# EAGLE design HTVC8038_Power_v12 (EAGLE 7.4.0)
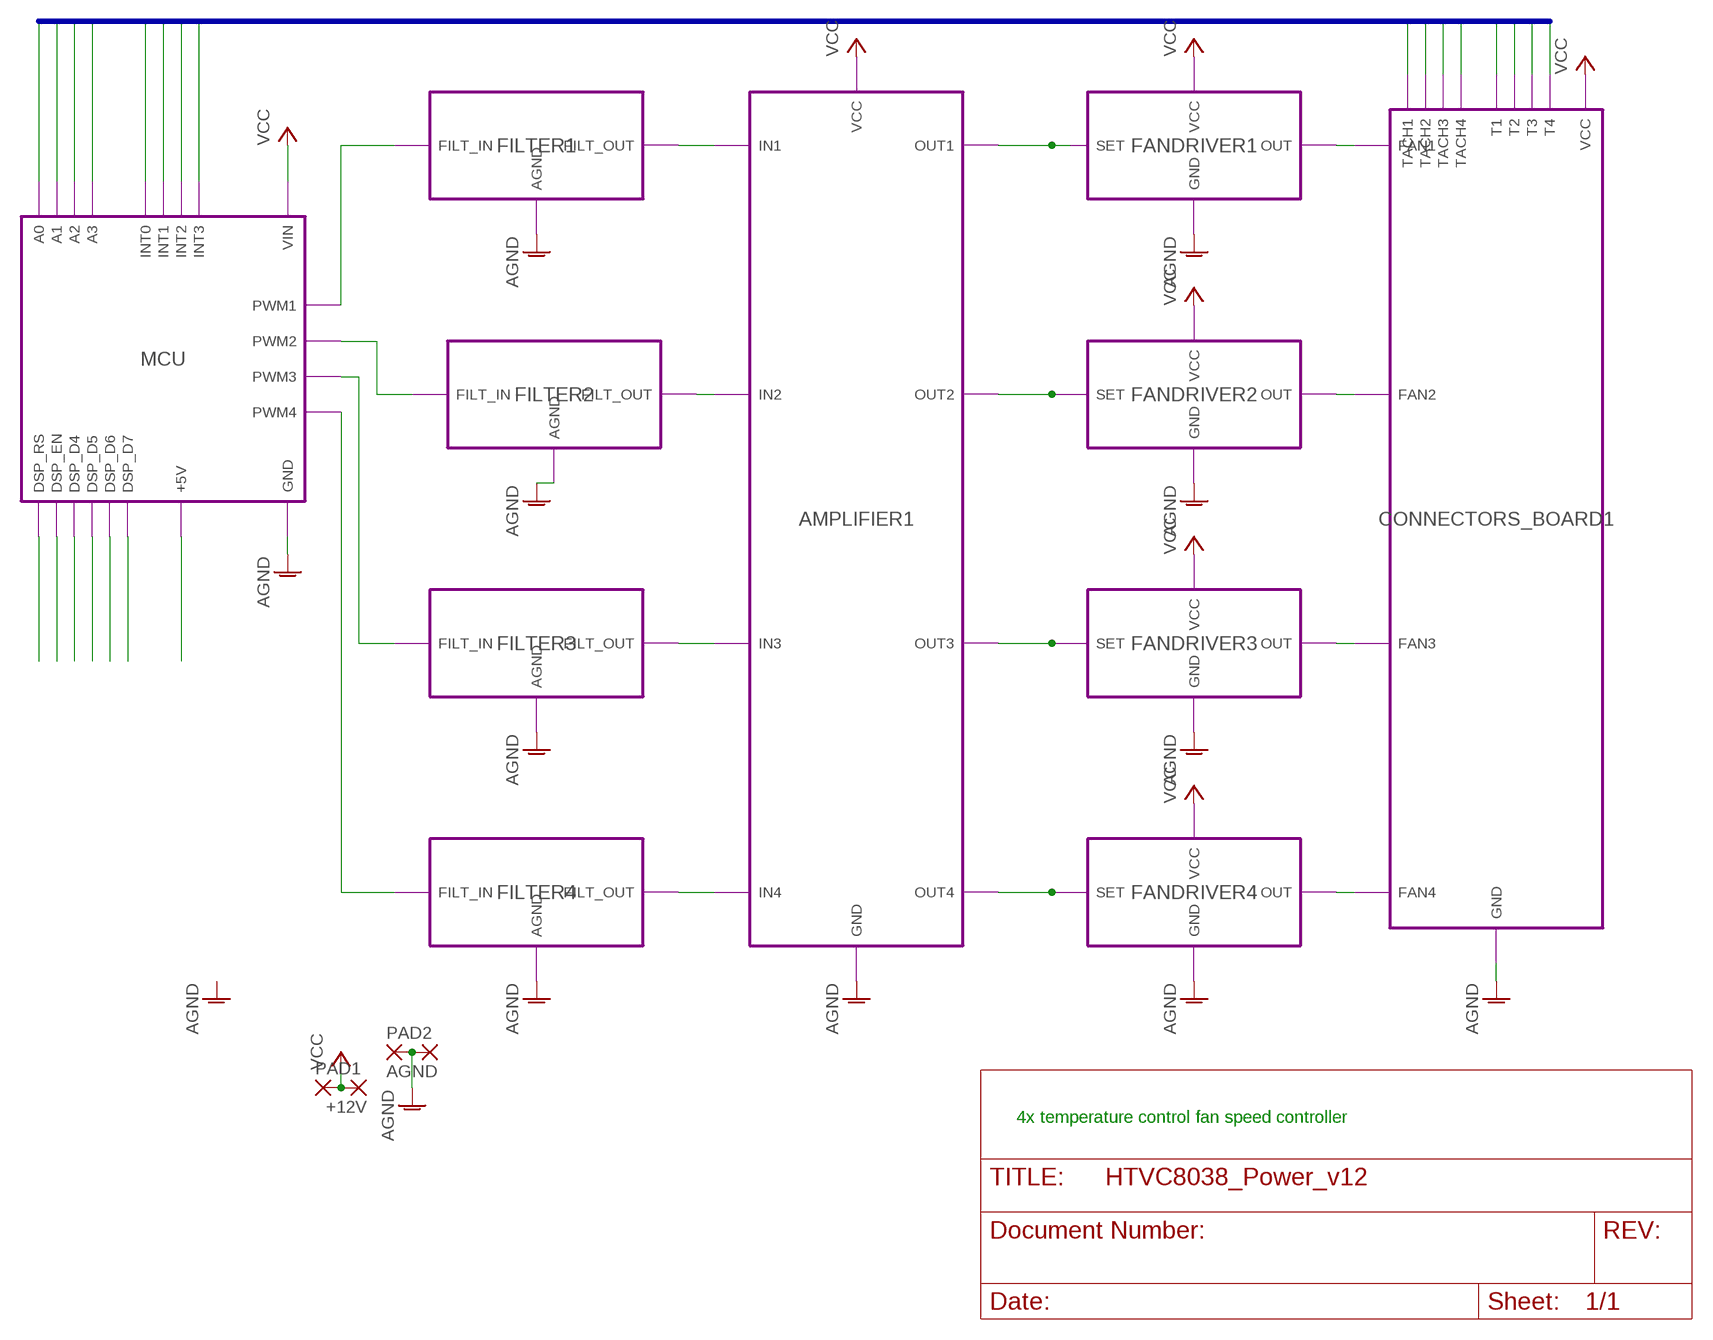
[diagram p0: schematic, sheet 1]

## Parts
+12V  3,17/1,3  [3,17/1,3]
AGND  3,17/1,3  [3,17/1,3]
PAD1  3,17/1,3  [3,17/1,3]
PAD2  3,17/1,3  [3,17/1,3]

## Module instances
FILTER1 = FILTER
FILTER2 = FILTER
FILTER3 = FILTER
FILTER4 = FILTER
MCU = MCU
CONNECTORS_BOARD1 = CONNECTORS_BOARD
AMPLIFIER1 = AMPLIFIER
FANDRIVER1 = FANDRIVER
FANDRIVER2 = FANDRIVER
FANDRIVER3 = FANDRIVER
FANDRIVER4 = FANDRIVER

## Nets
+5V [+5V]: port MCU.+5V
A0: port MCU.A0 CONNECTORS_BOARD1.T1
A1: port MCU.A1 CONNECTORS_BOARD1.T2
A2: port MCU.A2 CONNECTORS_BOARD1.T3
A3: port MCU.A3 CONNECTORS_BOARD1.T4
AGND [AGND]: AGND.1(P) PAD2.1(P) ; port FILTER1.AGND FILTER2.AGND FILTER3.AGND FILTER4.AGND AMPLIFIER1.GND FANDRIVER1.GND FANDRIVER2.GND FANDRIVER3.GND FANDRIVER4.GND MCU.GND CONNECTORS_BOARD1.GND
N$1: port MCU.DSP_RS
N$2: port MCU.DSP_EN
N$3: port MCU.DSP_D4
N$4: port MCU.DSP_D5
N$5: port MCU.DSP_D6
N$6: port MCU.DSP_D7
N$9: port FANDRIVER4.OUT CONNECTORS_BOARD1.FAN4
N$10: port FANDRIVER3.OUT CONNECTORS_BOARD1.FAN3
N$11: port FANDRIVER2.OUT CONNECTORS_BOARD1.FAN2
N$12: port FANDRIVER1.OUT CONNECTORS_BOARD1.FAN1
N$21: port MCU.PWM1 FILTER1.FILT_IN
N$22: port MCU.PWM2 FILTER2.FILT_IN
N$23: port MCU.PWM3 FILTER3.FILT_IN
N$37: port MCU.PWM4 FILTER4.FILT_IN
N$45: port FILTER1.FILT_OUT AMPLIFIER1.IN1
N$46: port FILTER2.FILT_OUT AMPLIFIER1.IN2
N$47: port FILTER3.FILT_OUT AMPLIFIER1.IN3
N$48: port FILTER4.FILT_OUT AMPLIFIER1.IN4
N$49: port FANDRIVER1.SET AMPLIFIER1.OUT1
N$50: port AMPLIFIER1.OUT2 FANDRIVER2.SET
N$51: port AMPLIFIER1.OUT3 FANDRIVER3.SET
N$52: port AMPLIFIER1.OUT4 FANDRIVER4.SET
TACH0: port MCU.INT0 CONNECTORS_BOARD1.TACH1
TACH1: port MCU.INT1 CONNECTORS_BOARD1.TACH2
TACH2: port MCU.INT2 CONNECTORS_BOARD1.TACH3
TACH3: port MCU.INT3 CONNECTORS_BOARD1.TACH4
VCC [VCC]: +12V.1(P) PAD1.1(P) ; port AMPLIFIER1.VCC FANDRIVER1.VCC FANDRIVER2.VCC FANDRIVER3.VCC FANDRIVER4.VCC CONNECTORS_BOARD1.VCC MCU.VIN

## Buses
A[0..3],TACH[0..3]

## Notes on the sheet
- 4x temperature control fan speed controller

## Library data of the parts
+12V AGND PAD1 PAD2 = wirepad:3,17/1,3: THROUGH-HOLE PAD

## Module DISPLAY_BOARD
Ports: VCC(pwr) GND(pwr) RS(io) EN(io) D4(io) D5(io) D6(io) D7(io)
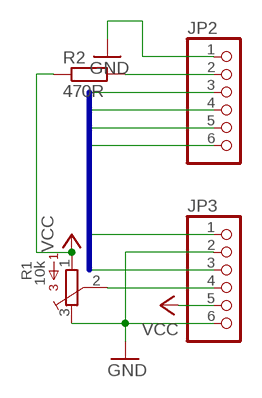
[diagram p1: schematic, module DISPLAY_BOARD, sheet 1]

### Parts
JP2  PINHD-1X6  [1X06]
JP3  PINHD-1X6  [1X06]
R1  10k  3362P  [3362P]
R2  470R  R-EU_0204/7  [0204/7]

### Nets
D4: JP2.6
D5: JP2.5
D6: JP2.4
D7: JP2.3
EN: JP3.1
GND: JP2.1 JP3.2 JP3.6 R1.3
N$1: JP3.4 R1.2
N$2: JP2.2 R2.2
RS: JP3.3
VCC: JP3.5 R1.1 R2.1

### Buses
D[4..7],BACKLIGHT,RS,EN

### Library data of the parts
JP2 JP3 = pinhead:PINHD-1X6: PIN HEADER
R1 = nervus:3362: 3362 Series 1/4" Square Trimmer
R2 = rcl:R-EU_: RESISTOR, European symbol

## Module CONNECTORS_BOARD
Ports: FAN1(io) FAN2(io) FAN3(io) FAN4(io) GND(io) TACH1(io) TACH2(io) TACH3(io) TACH4(io) T1(io) T2(io) T3(io) T4(io) VCC(pwr)
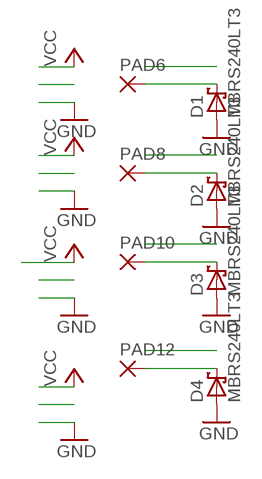
[diagram p2: schematic, module CONNECTORS_BOARD, sheet 1]

### Parts
D1  MBRS240LT3  [SMB-403A]
D2  MBRS240LT3  [SMB-403A]
D3  MBRS240LT3  [SMB-403A]
D4  MBRS240LT3  [SMB-403A]
PAD6  2,15/1,0  [2,15/1,0]
PAD8  2,15/1,0  [2,15/1,0]
PAD10  2,15/1,0  [2,15/1,0]
PAD12  2,15/1,0  [2,15/1,0]

### Nets
FAN1 [VCC]: D1.C PAD6.1(P)
FAN2 [VCC]: D2.C PAD8.1(P)
FAN3 [VCC]: D3.C PAD10.1(P)
FAN4 [VCC]: D4.C PAD12.1(P)
GND: D1.A D2.A D3.A D4.A

### Library data of the parts
D1-D4 = nervus:MBRS240LT3: Schottky Power Rectifier Source: http://www.onsemi.com/pub/Collateral/MBRS240LT3-D.PDF
PAD6 PAD8 PAD10 PAD12 = wirepad:2,15/1,0: THROUGH-HOLE PAD

## Module MCU
Ports: PWM1(out) PWM2(out) PWM3(out) PWM4(out) +5V(pwr) VIN(pwr) DSP_RS(io) DSP_EN(io) DSP_D4(io) DSP_D5(io) DSP_D6(io) DSP_D7(io) GND(pwr) A0(io) A1(io) A2(io) A3(io) INT0(io) INT1(io) INT2(io) INT3(io)
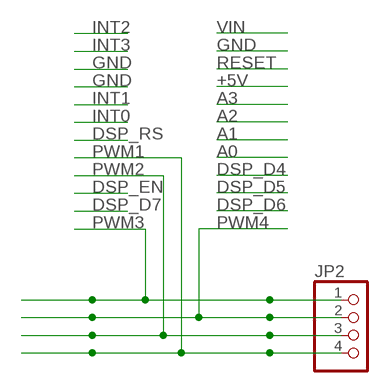
[diagram p3: schematic, module MCU, sheet 1]

### Parts
JP2  PINHD-1X4  [1X04]

### Nets
PWM1: JP2.4
PWM2: JP2.3
PWM3: JP2.1
PWM4: JP2.2

### Library data of the parts
JP2 = pinhead:PINHD-1X4: PIN HEADER

## Module FILTER
Ports: FILT_IN(in) FILT_OUT(out) AGND(pwr)
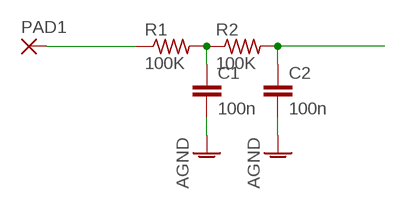
[diagram p4: schematic, module FILTER, sheet 1]

### Parts
C1  100n  C-EUC0805  [C0805]
C2  100n  C-EUC0805  [C0805]
PAD1  2,15/1,0  [2,15/1,0]
R1  100K  R-US_R0805  [R0805]
R2  100K  R-US_R0805  [R0805]

### Nets
AGND: C1.2 C2.2
FILT_IN: PAD1.1(P) R1.1
FILT_OUT: C2.1 R2.2
N$8: C1.1 R1.2 R2.1

### Library data of the parts
C1 C2 = resistor:C-EU: CAPACITOR, European symbol
PAD1 = wirepad:2,15/1,0: THROUGH-HOLE PAD
R1 R2 = resistor:R-US_: RESISTOR, American symbol

## Module FANDRIVER
Ports: SET(in) OUT(out) VCC(pwr) GND(pwr)
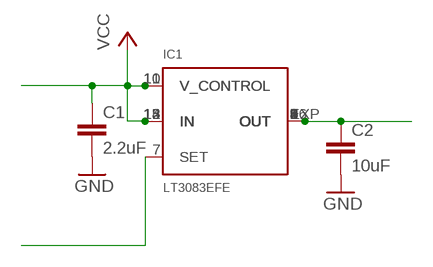
[diagram p5: schematic, module FANDRIVER, sheet 1]

### Parts
C1  2.2uF  C-EUC0805  [C0805]
C2  10uF  C-EUC1206  [C1206]
IC1  LT3083EFE  [TSSOP16EXP]

### Nets
GND: C1.2 C2.2
OUT: C2.1 IC1.1(OUT) IC1.2(OUT) IC1.3(OUT) IC1.4(OUT) IC1.5(OUT) IC1.6(OUT) IC1.8(OUT) IC1.9(OUT) IC1.16(OUT) IC1.EXP(OUT)
SET: IC1.7(SET)
VCC [VCC]: C1.1 IC1.10(V_CONTROL) IC1.11(V_CONTROL) IC1.12(IN) IC1.13(IN) IC1.14(IN) IC1.15(IN)

### Library data of the parts
C1 C2 = rcl:C-EU: CAPACITOR, European symbol
IC1 = nervus:LT3083

## Module AMPLIFIER
Ports: IN1(in) IN2(in) IN3(in) IN4(in) GND(pwr) VCC(pwr) OUT1(out) OUT2(out) OUT3(out) OUT4(out)
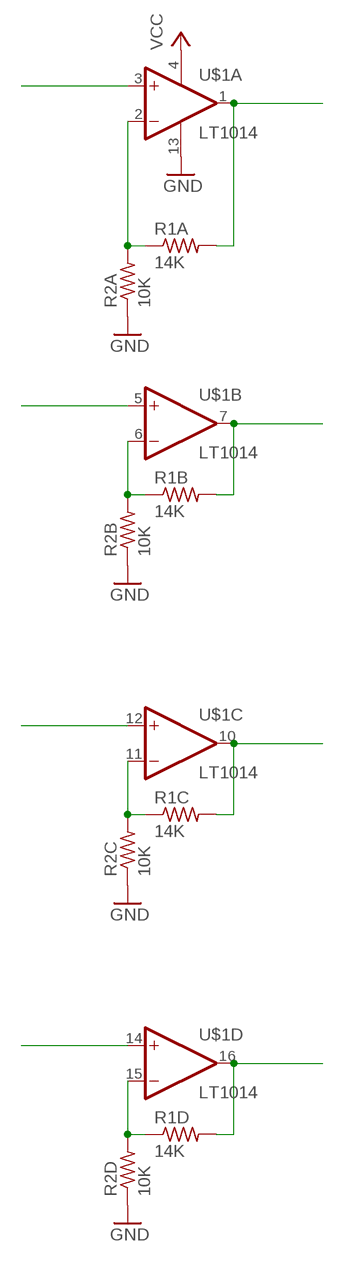
[diagram p6: schematic, module AMPLIFIER, sheet 1]

### Parts
R1A  14K  R-US_R0603  [R0603]
R1B  14K  R-US_R0603  [R0603]
R1C  14K  R-US_R0603  [R0603]
R1D  14K  R-US_R0603  [R0603]
R2A  10K  R-US_R0805  [R0805]
R2B  10K  R-US_R0805  [R0805]
R2C  10K  R-US_R0805  [R0805]
R2D  10K  R-US_R0805  [R0805]
U$1  LT1014  [SO16W]

### Nets
GND: R2A.1 R2B.1 R2C.1 R2D.1 U$1.13(P:V-)
IN1: U$1.3(A:+IN)
IN2: U$1.5(B:+IN)
IN3: U$1.12(C:+IN)
IN4: U$1.14(D:+IN)
N$1: R1B.1 R2B.2 U$1.6(B:-IN)
N$2: R1C.1 R2C.2 U$1.11(C:-IN)
N$3: R1D.1 R2D.2 U$1.15(D:-IN)
N$9: R1A.1 R2A.2 U$1.2(A:-IN)
OUT1: R1A.2 U$1.1(A:OUT)
OUT2: R1B.2 U$1.7(B:OUT)
OUT3: R1C.2 U$1.10(C:OUT)
OUT4: R1D.2 U$1.16(D:OUT)
VCC: U$1.4(P:V+)

### Library data of the parts
R1A R1B R1C R1D = rcl:R-US_: RESISTOR, American symbol
R2A R2B R2C R2D = resistor:R-US_: RESISTOR, American symbol
U$1 = nervus:LT1014: Quad Precision Op AmpDatasheet <http://cds.linear.com/docs/en/datasheet/10134fd.pdf>

## Net classes
0 default: clearance 0.203 mm
1 VCC: clearance 0.203 mm
2 AGND: clearance 0.203 mm
3 +5V: clearance 0.203 mm

## Board
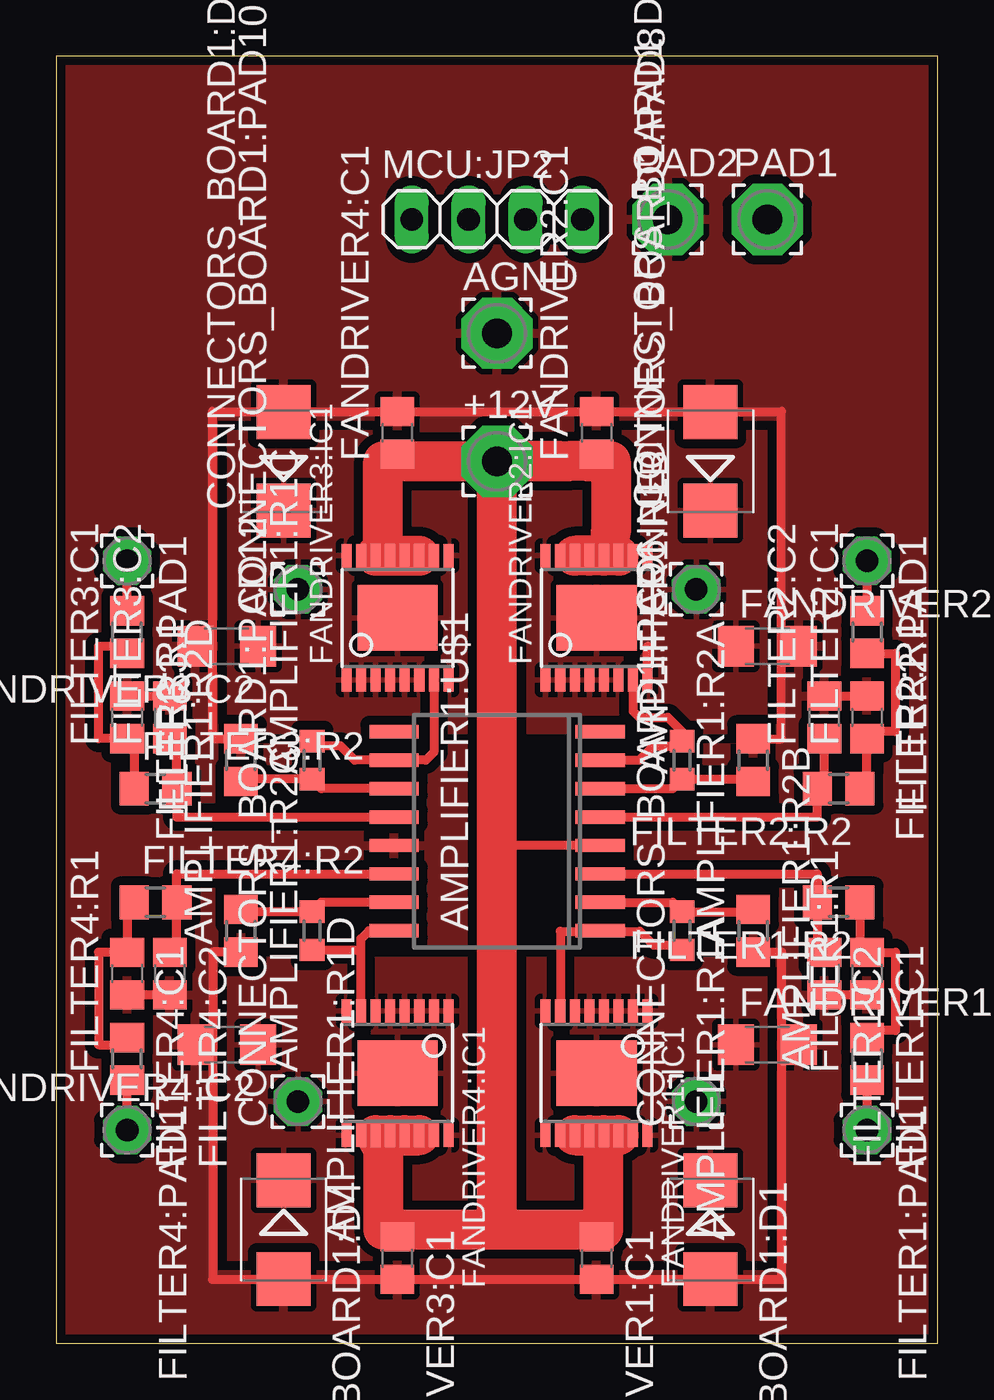
[diagram p7: board, top side]
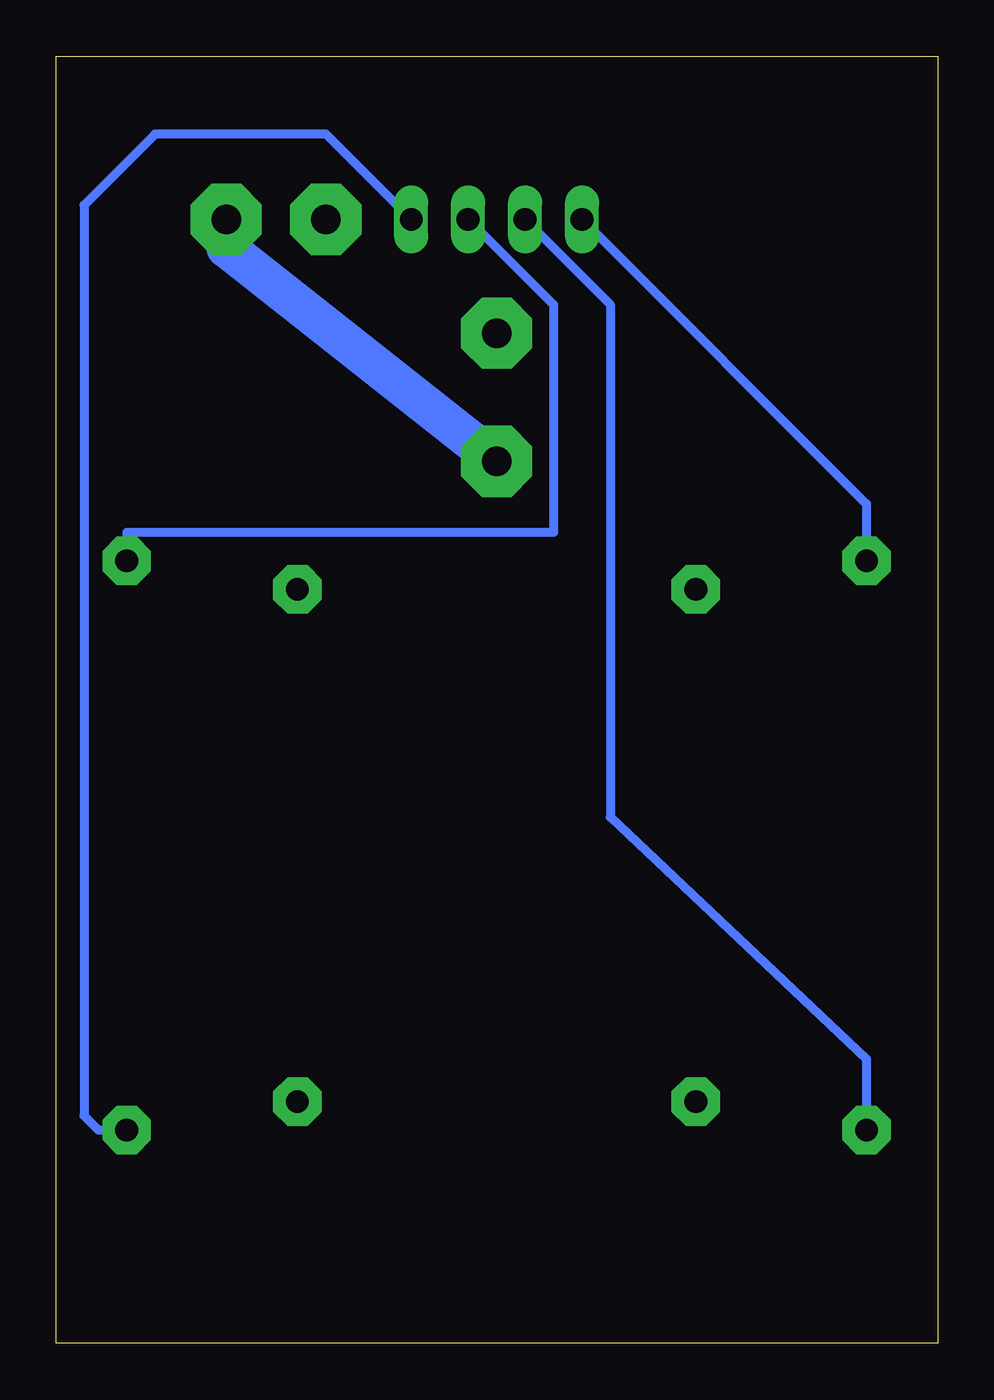
[diagram p8: board, bottom side, seen from below]

Size 39.35 x 57.46 mm. Coordinates in mm from the lower left corner, seen from the top.
Outline: 0,0 39.35,0 39.35,57.46 0,57.46 0,0
Copper layers (1*16): Top 0.0356mm / dielectric 1.5011mm / Bottom 0.0356mm
Design rules "LaenPCBOrder": minimum track width 6mil, minimum drill 13mil, track to track 6mil, track to pad 6mil, pad to pad 6mil, via to via 6mil, smd to smd 6mil, copper to edge 15mil, drill to drill 6mil, minimum pad ring 7mil, minimum via ring 7mil, stop-mask expansion 3mil, vias tented up to drill 0mil, thermal gap 10mil

### Footprints (pad centres in the part's own frame; a part is rotated, then mirrored left to right if it is on the bottom)
3,17/1,3 = drill 1.321 pad 3.175 octagon: 1 0,0
R0603 = smd 1 x 1.1: 1 -0.85,0; 2 0.85,0
R0805 = smd 1.3 x 1.5: 1 -0.95,0; 2 0.95,0
SO16W = smd 0.6 x 2.2: 1 -4.445,-4.6; 2 -3.175,-4.6; 3 -1.905,-4.6; 4 -0.635,-4.6; 5 0.635,-4.6; 6 1.905,-4.6; 7 3.175,-4.6; 8 4.445,-4.6; 9 4.445,4.6; 10 3.175,4.6; 11 1.905,4.6; 12 0.635,4.6; 13 -0.635,4.6; 14 -1.905,4.6; 15 -3.175,4.6; 16 -4.445,4.6
SMB-403A = smd 2.4 x 2.4: A 2.2,0; C -2.2,0
2,15/1,0 = drill 1.016 pad 2.159 octagon: 1 0,0
C0805 = smd 1.3 x 1.5: 1 -0.95,0; 2 0.95,0
C1206 = smd 1.6 x 1.8: 1 -1.4,0; 2 1.4,0
TSSOP16EXP = smd 0.45 x 1.05: 1 -2.275,-2.768; 2 -1.625,-2.768; 3 -0.975,-2.768; 4 -0.325,-2.768; 5 0.325,-2.768; 6 0.975,-2.768; 7 1.625,-2.768; 8 2.275,-2.768; 9 2.275,2.768; 10 1.625,2.768; 11 0.975,2.768; 12 0.325,2.768; 13 -0.325,2.768; 14 -0.975,2.768; 15 -1.625,2.768; 16 -2.275,2.768 | smd 3.58 x 2.94: EXP 0,0
1X04 = drill 1.016 long: 1 -3.81,0; 2 -1.27,0; 3 1.27,0; 4 3.81,0

### Placement (x,y rotation side)
+12V  19.69,39.37 0 top
AGND  19.69,45.09 0 top
AMPLIFIER1:R1A  14K  [R0603]  27.94,18.41 270 top
AMPLIFIER1:R1B  14K  [R0603]  27.94,26.04 90 top
AMPLIFIER1:R1C  14K  [R0603]  11.43,26.04 90 top
AMPLIFIER1:R1D  14K  [R0603]  11.43,18.41 270 top
AMPLIFIER1:R2A  10K  [R0805]  31.11,18.41 90 top
AMPLIFIER1:R2B  10K  [R0805]  31.11,26.04 270 top
AMPLIFIER1:R2C  10K  [R0805]  8.26,26.04 270 top
AMPLIFIER1:R2D  10K  [R0805]  8.26,18.41 90 top
AMPLIFIER1:U$1  LT1014  [SO16W]  19.69,22.86 90 top
CONNECTORS_BOARD1:D1  MBRS240LT3  [SMB-403A]  29.21,5.08 270 top
CONNECTORS_BOARD1:D2  MBRS240LT3  [SMB-403A]  29.21,39.37 90 top
CONNECTORS_BOARD1:D3  MBRS240LT3  [SMB-403A]  10.16,39.37 90 top
CONNECTORS_BOARD1:D4  MBRS240LT3  [SMB-403A]  10.16,5.08 270 top
CONNECTORS_BOARD1:PAD6  [2,15/1,0]  28.58,10.79 90 top
CONNECTORS_BOARD1:PAD8  [2,15/1,0]  28.58,33.66 90 top
CONNECTORS_BOARD1:PAD10  [2,15/1,0]  10.8,33.66 90 top
CONNECTORS_BOARD1:PAD12  [2,15/1,0]  10.8,10.79 90 top
FANDRIVER1:C1  2.2uF  [C0805]  24.13,3.81 270 top
FANDRIVER1:C2  10uF  [C1206]  31.75,13.34 0 top
FANDRIVER1:IC1  LT3083EFE  [TSSOP16EXP]  24.13,12.06 180 top
FANDRIVER2:C1  2.2uF  [C0805]  24.13,40.64 90 top
FANDRIVER2:C2  10uF  [C1206]  31.75,31.11 0 top
FANDRIVER2:IC1  LT3083EFE  [TSSOP16EXP]  24.13,32.39 0 top
FANDRIVER3:C1  2.2uF  [C0805]  15.24,3.81 270 top
FANDRIVER3:C2  10uF  [C1206]  7.62,31.11 180 top
FANDRIVER3:IC1  LT3083EFE  [TSSOP16EXP]  15.24,32.39 0 top
FANDRIVER4:C1  2.2uF  [C0805]  15.24,40.64 90 top
FANDRIVER4:C2  10uF  [C1206]  7.62,13.34 180 top
FANDRIVER4:IC1  LT3083EFE  [TSSOP16EXP]  15.24,12.06 180 top
FILTER1:C1  100n  [C0805]  36.19,16.51 270 top
FILTER1:C2  100n  [C0805]  34.29,16.51 270 top
FILTER1:PAD1  [2,15/1,0]  36.19,9.53 270 top
FILTER1:R1  100K  [R0805]  36.19,12.7 90 top
FILTER1:R2  100K  [R0805]  34.92,19.68 180 top
FILTER2:C1  100n  [C0805]  36.19,27.94 90 top
FILTER2:C2  100n  [C0805]  34.29,27.94 90 top
FILTER2:PAD1  [2,15/1,0]  36.19,34.93 270 top
FILTER2:R1  100K  [R0805]  36.19,31.75 270 top
FILTER2:R2  100K  [R0805]  34.92,24.76 180 top
FILTER3:C1  100n  [C0805]  3.17,27.94 90 top
FILTER3:C2  100n  [C0805]  5.08,27.94 90 top
FILTER3:PAD1  [2,15/1,0]  3.17,34.93 270 top
FILTER3:R1  100K  [R0805]  3.17,31.75 270 top
FILTER3:R2  100K  [R0805]  4.45,24.76 0 top
FILTER4:C1  100n  [C0805]  3.17,16.51 270 top
FILTER4:C2  100n  [C0805]  5.08,16.51 270 top
FILTER4:PAD1  [2,15/1,0]  3.17,9.53 270 top
FILTER4:R1  100K  [R0805]  3.17,12.7 90 top
FILTER4:R2  100K  [R0805]  4.45,19.68 0 top
MCU:JP2  [1X04]  19.69,50.16 0 top
PAD1  31.75,50.16 0 top
PAD2  27.3,50.16 0 top

### Tracks (layer width: path | path; a pad name or v marks a point on that pad's centre or on a via)
AGND
  Top 0.406: FILTER1:C1.2 FILTER1:C2.2 | 31.43,17.14 AMPLIFIER1:R2A.1 32.39,17.46 32.39,2.86 FANDRIVER1:C1.2 FANDRIVER3:C1.2 6.98,2.86 6.98,17.46 AMPLIFIER1:R2D.1 | FILTER2:C2.2 FILTER2:C1.2 | 3.17,15.88 FILTER4:C1.2 FILTER4:C2.2 | FILTER3:C1.2 FILTER3:C2.2 | AMPLIFIER1:R2C.1 6.98,26.98 6.98,41.59 FANDRIVER4:C1.2 FANDRIVER2:C1.2 32.39,41.59 32.39,26.98 AMPLIFIER1:R2B.1
  pour Top (isolate 0.406, rank 2): 39.37,57.15 39.37,0 0,0 0,57.15
AMPLIFIER1:N$1
  Top 0.406: AMPLIFIER1:U$1.6 27.52,24.76 AMPLIFIER1:R1B.1 31.02,25.18 AMPLIFIER1:R2B.2
AMPLIFIER1:N$2
  Top 0.406: AMPLIFIER1:U$1.11 11.85,24.76 AMPLIFIER1:R1C.1 8.35,25.18 AMPLIFIER1:R2C.2
AMPLIFIER1:N$3
  Top 0.406: AMPLIFIER1:U$1.15 11.85,19.68 AMPLIFIER1:R1D.1 8.35,19.26 AMPLIFIER1:R2D.2
AMPLIFIER1:N$9
  Top 0.406: AMPLIFIER1:U$1.2 27.52,19.68 AMPLIFIER1:R1A.1 31.02,19.26 AMPLIFIER1:R2A.2
FILTER1:N$8
  Top 0.406: FILTER1:R2.1 35.88,17.77 FILTER1:C1.1 37.47,17.46 37.47,13.97 36.19,13.97 FILTER1:R1.2
FILTER2:N$8
  Top 0.406: FILTER2:R2.1 36.19,24.76 FILTER2:C1.1 36.19,27.3 37.47,27.3 37.47,30.8 FILTER2:R1.2
FILTER3:N$8
  Top 0.406: 3.81,25.08 FILTER3:R2.1 3.49,26.99 FILTER3:C1.1 1.91,26.99 1.91,31.11 3.17,31.11 FILTER3:R1.2
FILTER4:N$8
  Top 0.406: FILTER4:R2.1 3.17,19.68 FILTER4:C1.1 1.91,17.46 1.91,13.34 3.17,13.34 FILTER4:R1.2
N$9
  pour Top (isolate 0.406): 7.62,17.14 18.41,17.14 18.41,3.81 7.62,3.81
N$10
  pour Top (isolate 0.406): 7.62,40.64 18.41,40.64 18.41,27.3 7.62,27.3
N$11
  Top 0.406: FANDRIVER2:IC1.8 26.41,31.11
  pour Top (isolate 0.406): 20.95,40.64 31.75,40.64 31.75,27.3 20.95,27.3
N$12
  pour Top (isolate 0.406): 20.95,17.14 31.75,17.14 31.75,3.81 20.95,3.81
N$21
  Top 0.406: FILTER1:R1.1 FILTER1:PAD1.1
  Bottom 0.406: MCU:JP2.4 27.3,53.98 34.92,53.98 38.1,50.8 38.1,10.16 37.47,9.53 FILTER1:PAD1.1
N$22
  Top 0.406: FILTER2:PAD1.1 FILTER2:R1.1
  Bottom 0.406: MCU:JP2.3 17.14,46.36 17.14,36.2 36.19,36.2 FILTER2:PAD1.1
N$23
  Top 0.406: FILTER3:R1.1 FILTER3:PAD1.1
  Bottom 0.406: MCU:JP2.1 3.17,37.47 FILTER3:PAD1.1
N$37
  Top 0.406: FILTER4:PAD1.1 FILTER4:R1.1
  Bottom 0.406: MCU:JP2.2 14.6,46.36 14.6,23.49 3.17,12.7 FILTER4:PAD1.1
N$45
  Top 0.406: FILTER1:C2.1 33.97,17.78 FILTER1:R2.2 33.97,20.95 AMPLIFIER1:U$1.3
N$46
  Top 0.406: AMPLIFIER1:U$1.5 33.97,23.49 FILTER2:R2.2 | FILTER2:R2.2 33.66,24.76 | FILTER2:R2.2 34.29,24.76 FILTER2:C2.1
N$47
  Top 0.406: AMPLIFIER1:U$1.12 5.39,23.49 FILTER3:R2.2 5.39,26.67 FILTER3:C2.1
N$48
  Top 0.406: FILTER4:C2.1 5.39,17.46 FILTER4:R2.2 5.39,20.95 AMPLIFIER1:U$1.14
N$49
  Top 0.152: AMPLIFIER1:U$1.1 24.26,18.39
  Top 0.406: FANDRIVER1:IC1.7 22.51,18.39 24.26,18.39 26.05,18.39 26.67,17.78 27.72,17.78 AMPLIFIER1:R1A.2
N$50
  Top 0.406: AMPLIFIER1:U$1.7 26.03,26.04 26.67,26.67 27.72,26.67 AMPLIFIER1:R1B.2 27.94,27.3 27.3,27.94 26.03,27.94 25.75,28.22 FANDRIVER2:IC1.7
N$51
  Top 0.406: FANDRIVER3:IC1.7 16.87,26.39 16.51,26.04 AMPLIFIER1:U$1.10 13.34,26.04 12.7,26.67 11.64,26.67 AMPLIFIER1:R1C.2
N$52
  Top 0.406: FANDRIVER4:IC1.7 13.62,17.56 | 13.62,17.56 13.62,18.06 13.97,18.41 AMPLIFIER1:U$1.16 | AMPLIFIER1:R1D.2 13.62,17.56
VCC
  Top 0.152: FANDRIVER2:IC1.15 22.48,35.19 FANDRIVER2:IC1.14 | FANDRIVER2:IC1.13 24.44,35.19 FANDRIVER2:IC1.12 24.52,35.37 24.77,36.2 | FANDRIVER2:IC1.10 25.77,35.19 FANDRIVER2:IC1.11 | FANDRIVER4:IC1.10 13.59,9.32 FANDRIVER4:IC1.11 | 15.63,39.37 15.63,39.55 FANDRIVER4:C1.1 | FANDRIVER4:IC1.12 14.92,9.32 14.6,8.66 | FANDRIVER4:IC1.13 15.55,9.32 15.55,9.3 | FANDRIVER4:IC1.15 16.88,9.32 FANDRIVER4:IC1.14 | FANDRIVER1:IC1.10 22.48,9.32 FANDRIVER1:IC1.11 | FANDRIVER1:IC1.12 23.81,9.32 FANDRIVER1:IC1.13 | FANDRIVER1:IC1.15 25.77,9.32 FANDRIVER1:IC1.14 | FANDRIVER3:IC1.15 13.59,35.19 FANDRIVER3:IC1.14 | FANDRIVER3:IC1.12 15.55,35.19 FANDRIVER3:IC1.13 | FANDRIVER3:IC1.10 16.88,35.19 FANDRIVER3:IC1.11 | FANDRIVER3:C1.1 15.28,4.79 14.6,5.08 | FANDRIVER1:C1.1 24.17,4.79 24.17,5.08 | 24.17,39.37 24.17,39.73 FANDRIVER2:C1.1 23.72,39.37
  Top 0.406: 15.52,39.69 FANDRIVER4:C1.1 | AMPLIFIER1:U$1.4 19.69,22.22 | 24.42,8.63 FANDRIVER1:IC1.13
  Top 1.778: 22.56,39.37 +12V.1 | FANDRIVER3:IC1.14 FANDRIVER3:IC1.13 | FANDRIVER3:IC1.13 FANDRIVER3:IC1.12 FANDRIVER3:IC1.11 | FANDRIVER2:IC1.11 FANDRIVER2:IC1.12 FANDRIVER2:IC1.13 FANDRIVER2:IC1.14 | 19.69,5.08 24.17,5.08 24.42,5.08 24.42,8.63 | 19.69,5.08 14.6,5.08 14.6,8.66 FANDRIVER4:IC1.11 FANDRIVER4:IC1.12 15.55,9.3 FANDRIVER4:IC1.13 FANDRIVER4:IC1.14 | FANDRIVER1:IC1.11 FANDRIVER1:IC1.12 FANDRIVER1:IC1.13 FANDRIVER1:IC1.14 | 19.69,5.08 19.69,22.22 +12V.1 | FANDRIVER3:IC1.13 14.6,35.79 14.6,39.37 15.24,39.37 15.63,39.37 +12V.1 | +12V.1 22.86,39.37 23.72,39.37 24.17,39.37 24.44,39.37 24.77,39.37 24.77,36.2
  Bottom 0.406: 31.11,50.16 PAD1.1
  Bottom 1.778: PAD1.1 31.75,48.9 +12V.1